# Altium schematic sheet Cell.SchDoc
size A; SheetNumber: 5
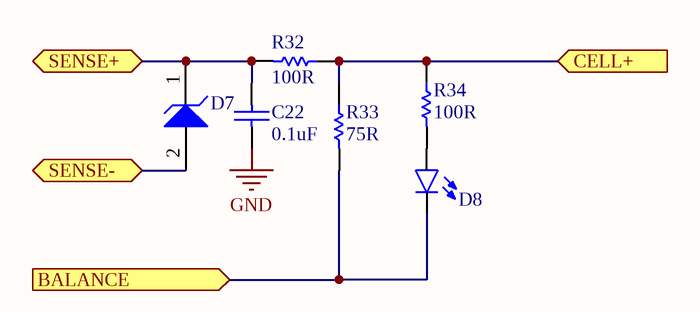
[diagram p0: Cell.SchDoc]

## Parts
C22  value 0.1uF  [C0402[1005X55]]  (hidden comment: 0.1uF 6.3V 0402)
D7  MM3Z12VT1G  [ONSC-SOD-323-2-477-02_V]  (value not drawn)
D8  LED_0603  [LED0603]  (value not drawn)
R32  value 100R  [R0402[1005]]  (hidden comment: 100R 1% 0402)
R33  value 75R  [R0603[1608]]  (hidden comment: 75R 1% 0603)
R34  value 100R  [R0402[1005]]  (hidden comment: 100R 1% 0402)

## Ports
BALANCE (in), CELL+ (in), SENSE+, SENSE- (bidir)

## Nets
GND: C22.1
BALANCE: D8.C R33.1 ; port BALANCE
CELL+: R32.2 R33.2 R34.2 ; port CELL+
SENSE+: C22.2 D7.1(K) R32.1 ; port SENSE+
SENSE-: D7.2(A) ; port SENSE-
NetD8_A: D8.A R34.1

## Library data of the parts
C22 = CAP_0.1uF_6.3V_0402_10%: 0.1uF 6.3V 10% 0402 (1005 Metric); PartNumber: GRM155R70J104KA01D; Manufacturer: Murata; Tolerance: 10%; Mounting Technology: Surface Mount; PackageReference: 0402; PackageDescription: 0402 (1005 Metric); Voltage: 6.3V
D7 = CMP-1060-00726-1: Zener Voltage Regulator, 300 mW, 2-Pin SOD-323, Tape and Reel; Manufacturer: On Semiconductor; VZ Typ (V): 12; P Max (W): 0.3; Packing: Tape and Reel; ComponentLink3URL: http://www.onsemi.com/pub_link/Collateral/477-02.PDF.1; ComponentLink2Description: Datasheet; Mounting Technology: Surface Mount; PackageVersion: Rev. H, 03/2007; PackageDescription: 2-Pin SOD, Body 1.7 x 1.25 mm; ComponentLink1URL: http://www.onsemi.com/; ComponentLink1Description: Manufacturer URL; PartNumber: MM3Z12VT1G; ComponentLink3Description: Package Specification; ComponentLink2URL: http://www.onsemi.cn/pub_link/Collateral/MM3Z2V4T1-D.PDF; DatasheetVersion: Rev. 9; PackageReference: SOD-323-2-477-02
D8 = LED_0603: PartNumber: LTST-C193TBKT-5A; Manufacturer: Lite-On Inc.; PackageReference: 0603; PackageDescription: 0603 (1608 Metric); Mounting Technology: Surface Mount
R32 R34 = RES_100R_0402_1%: 100R 0.063W 1% 0402 (1005 Metric); Manufacturer: KOA Speer; PartNumber: RK73H1ETTP1000F; Power: 0.063W; Tolerance: 1%; Mounting Technology: Surface Mount; PackageReference: 0402; PackageDescription: 0402 (1005 Metric); ComponentLink1Description: Datasheet; ComponentLink1URL: http://www.koaspeer.com/catimages/Products/RK73H/RK73H.pdf
R33 = RES_75R_0603_1%: 75R 0.25W 1% 0603 (1005 Metric); Manufacturer: Vishay / Dale; PartNumber: CRCW060375R0FKEAHP; Tolerance: 1%; Power: 0.25W; Mounting Technology: Surface Mount; PackageReference: 0603; PackageDescription: 0603 (1608 Metric); ComponentLink1Description: Datasheet; ComponentLink1URL: http://www.vishay.com/docs/20043/crcwhpe3.pdf